# EAGLE design Köpfhörerverstärker PSU Rev 1.1 (EAGLE 6.4)

## Sheet 1 of 2
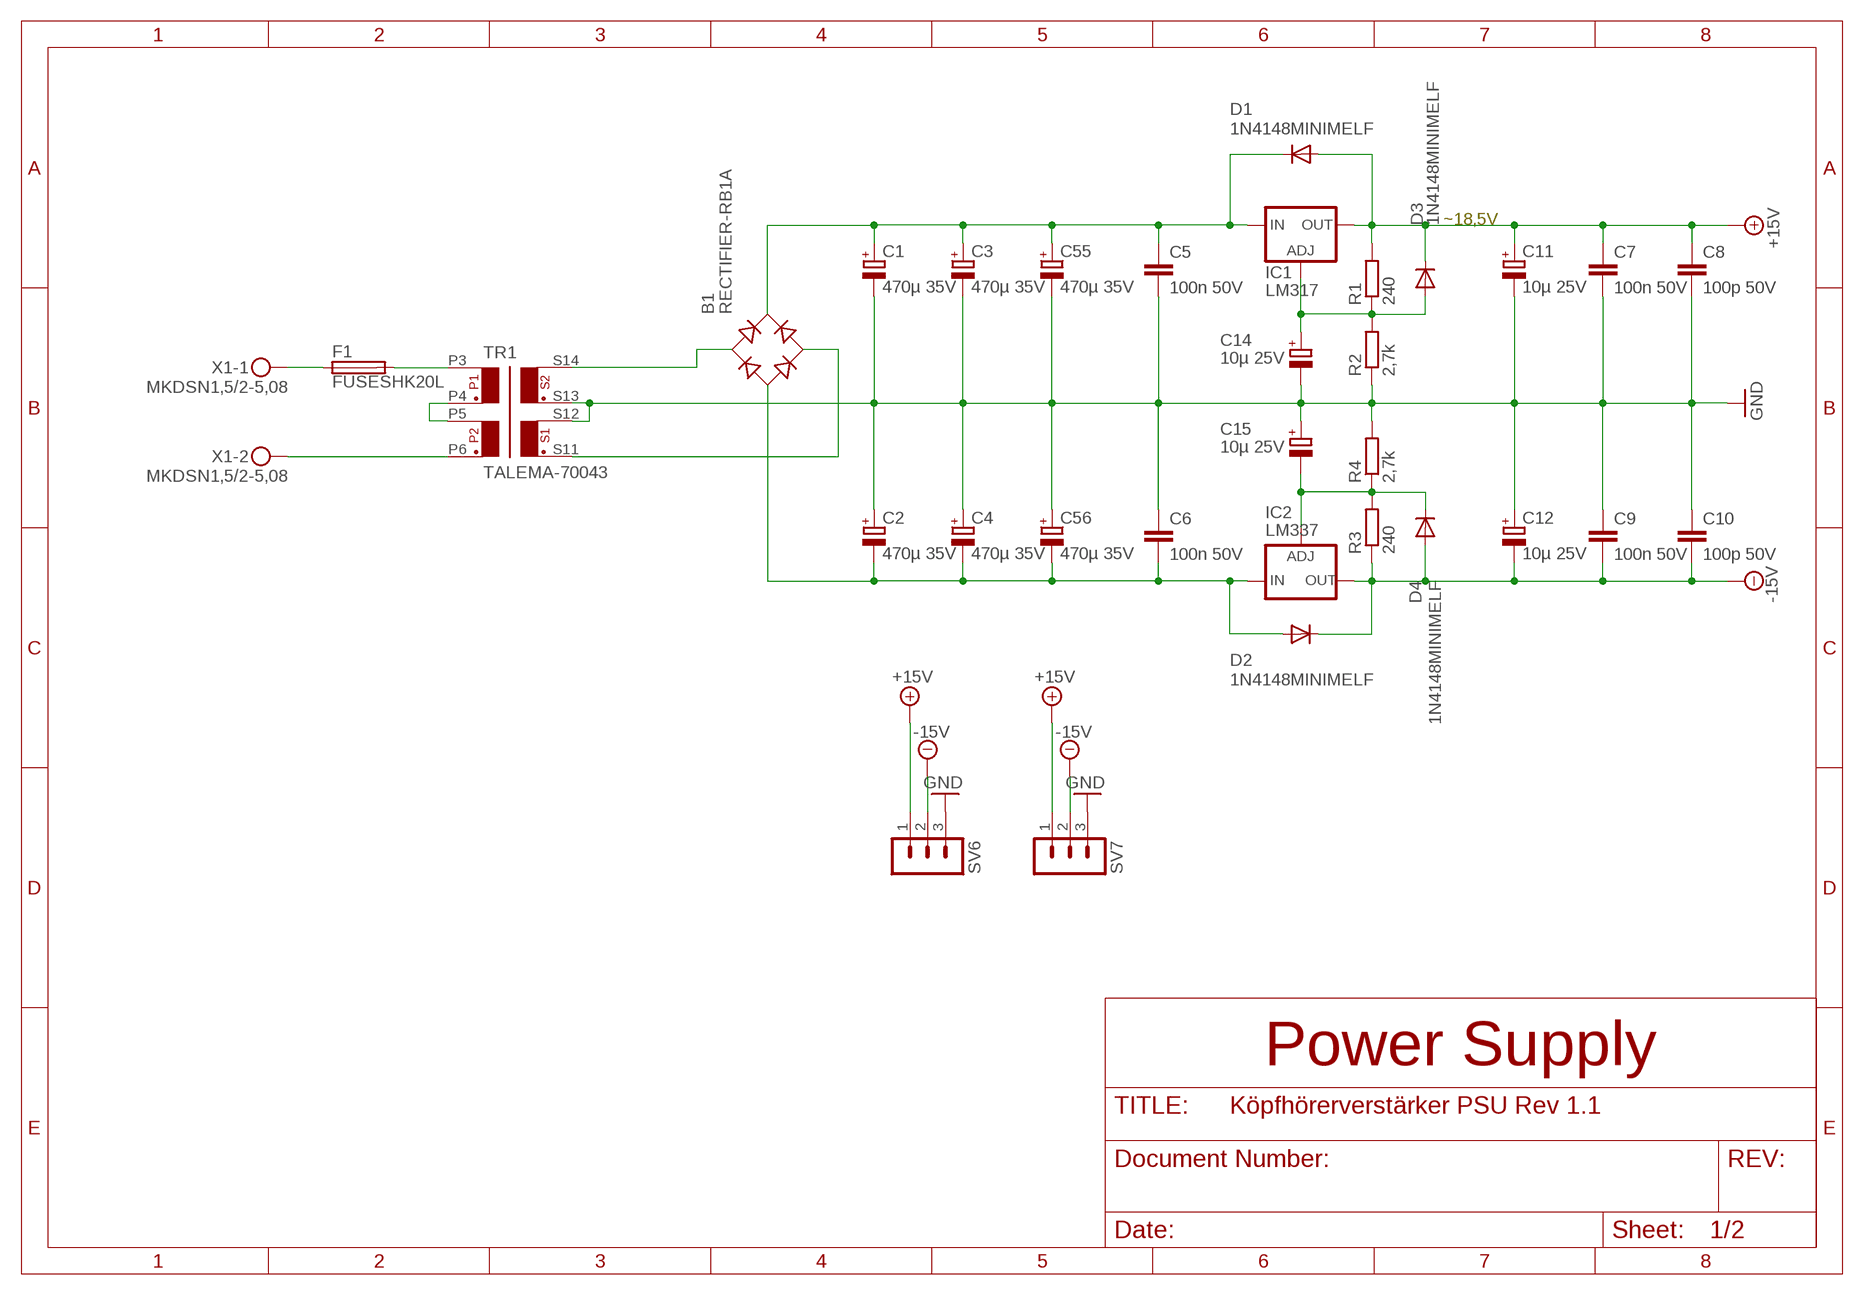
[diagram p0: schematic, sheet 1]

### Parts
B1  RECTIFIER-RB1A  [RB1A]
C1  470µ 35V  CPOL-EUE5-10.5  [E5-10,5]
C2  470µ 35V  CPOL-EUE5-10.5  [E5-10,5]
C3  470µ 35V  CPOL-EUE5-10.5  [E5-10,5]
C4  470µ 35V  CPOL-EUE5-10.5  [E5-10,5]
C5  100n 50V  C-EUC0805  [C0805]
C6  100n 50V  C-EUC0805  [C0805]
C7  100n 50V  C-EUC0805  [C0805]
C8  100p 50V  C-EUC0805  [C0805]
C9  100n 50V  C-EUC0805  [C0805]
C10  100p 50V  C-EUC0805  [C0805]
C11  10µ 25V  CPOL-EUE2.5-5  [E2,5-5]
C12  10µ 25V  CPOL-EUE2.5-5  [E2,5-5]
C14  10µ 25V  CPOL-EUE2.5-5  [E2,5-5]
C15  10µ 25V  CPOL-EUE2.5-5  [E2,5-5]
C55  470µ 35V  CPOL-EUE5-10.5  [E5-10,5]
C56  470µ 35V  CPOL-EUE5-10.5  [E5-10,5]
D1  1N4148MINIMELF  [MINIMELF]
D2  1N4148MINIMELF  [MINIMELF]
D3  1N4148MINIMELF  [MINIMELF]
D4  1N4148MINIMELF  [MINIMELF]
F1  FUSESHK20L  [SHK20L]
IC1  LM317  LM317TL  [317TL]
IC2  LM337  LM337TL  [337TL]
R1  240  R-EU_R0805  [R0805]
R2  2,7k  R-EU_R0805  [R0805]
R3  240  R-EU_R0805  [R0805]
R4  2,7k  R-EU_R0805  [R0805]
SV6  MA03-1  [MA03-1]
SV7  MA03-1  [MA03-1]
TR1  TALEMA-70043  [TALEMA-70043]
X1  MKDSN1,5/2-5,08  [MKDSN1,5/2-5,08]

### Nets
+15V: C7.1 C8.1 C11.+ D1.A D3.C IC1.2(OUT) R1.2 SV6.1 SV7.1 ; also sheet 2
-15V: C9.2 C10.2 C12.- D2.C D4.A IC2.3(OUT) R3.1 SV6.2 SV7.2 ; also sheet 2
GND: C1.- C2.+ C3.- C4.+ C5.2 C6.1 C7.2 C8.2 C9.1 C10.1 C11.- C12.+ C14.- C15.+ C55.- C56.+ R2.1 R4.2 SV6.3 SV7.3 TR1.S12 TR1.S13 ; also sheet 2
N$1: F1.2A TR1.P3
N$2: F1.1A X1.1
N$3: TR1.P6 X1.2
N$4: TR1.P4 TR1.P5
N$5: B1.AC2 TR1.S11
N$6: B1.AC1 TR1.S14
N$8: C14.+ D3.A IC1.1(ADJ) R1.1 R2.2
N$9: C15.- D4.C IC2.1(ADJ) R3.2 R4.1
N$10: B1.- C2.- C4.- C6.2 C56.- D2.A IC2.2(IN)
N$11: B1.+ C1.+ C3.+ C5.1 C55.+ D1.C IC1.3(IN)

### Notes on the sheet
- ~18,5V
- Power Supply

## Sheet 2 of 2
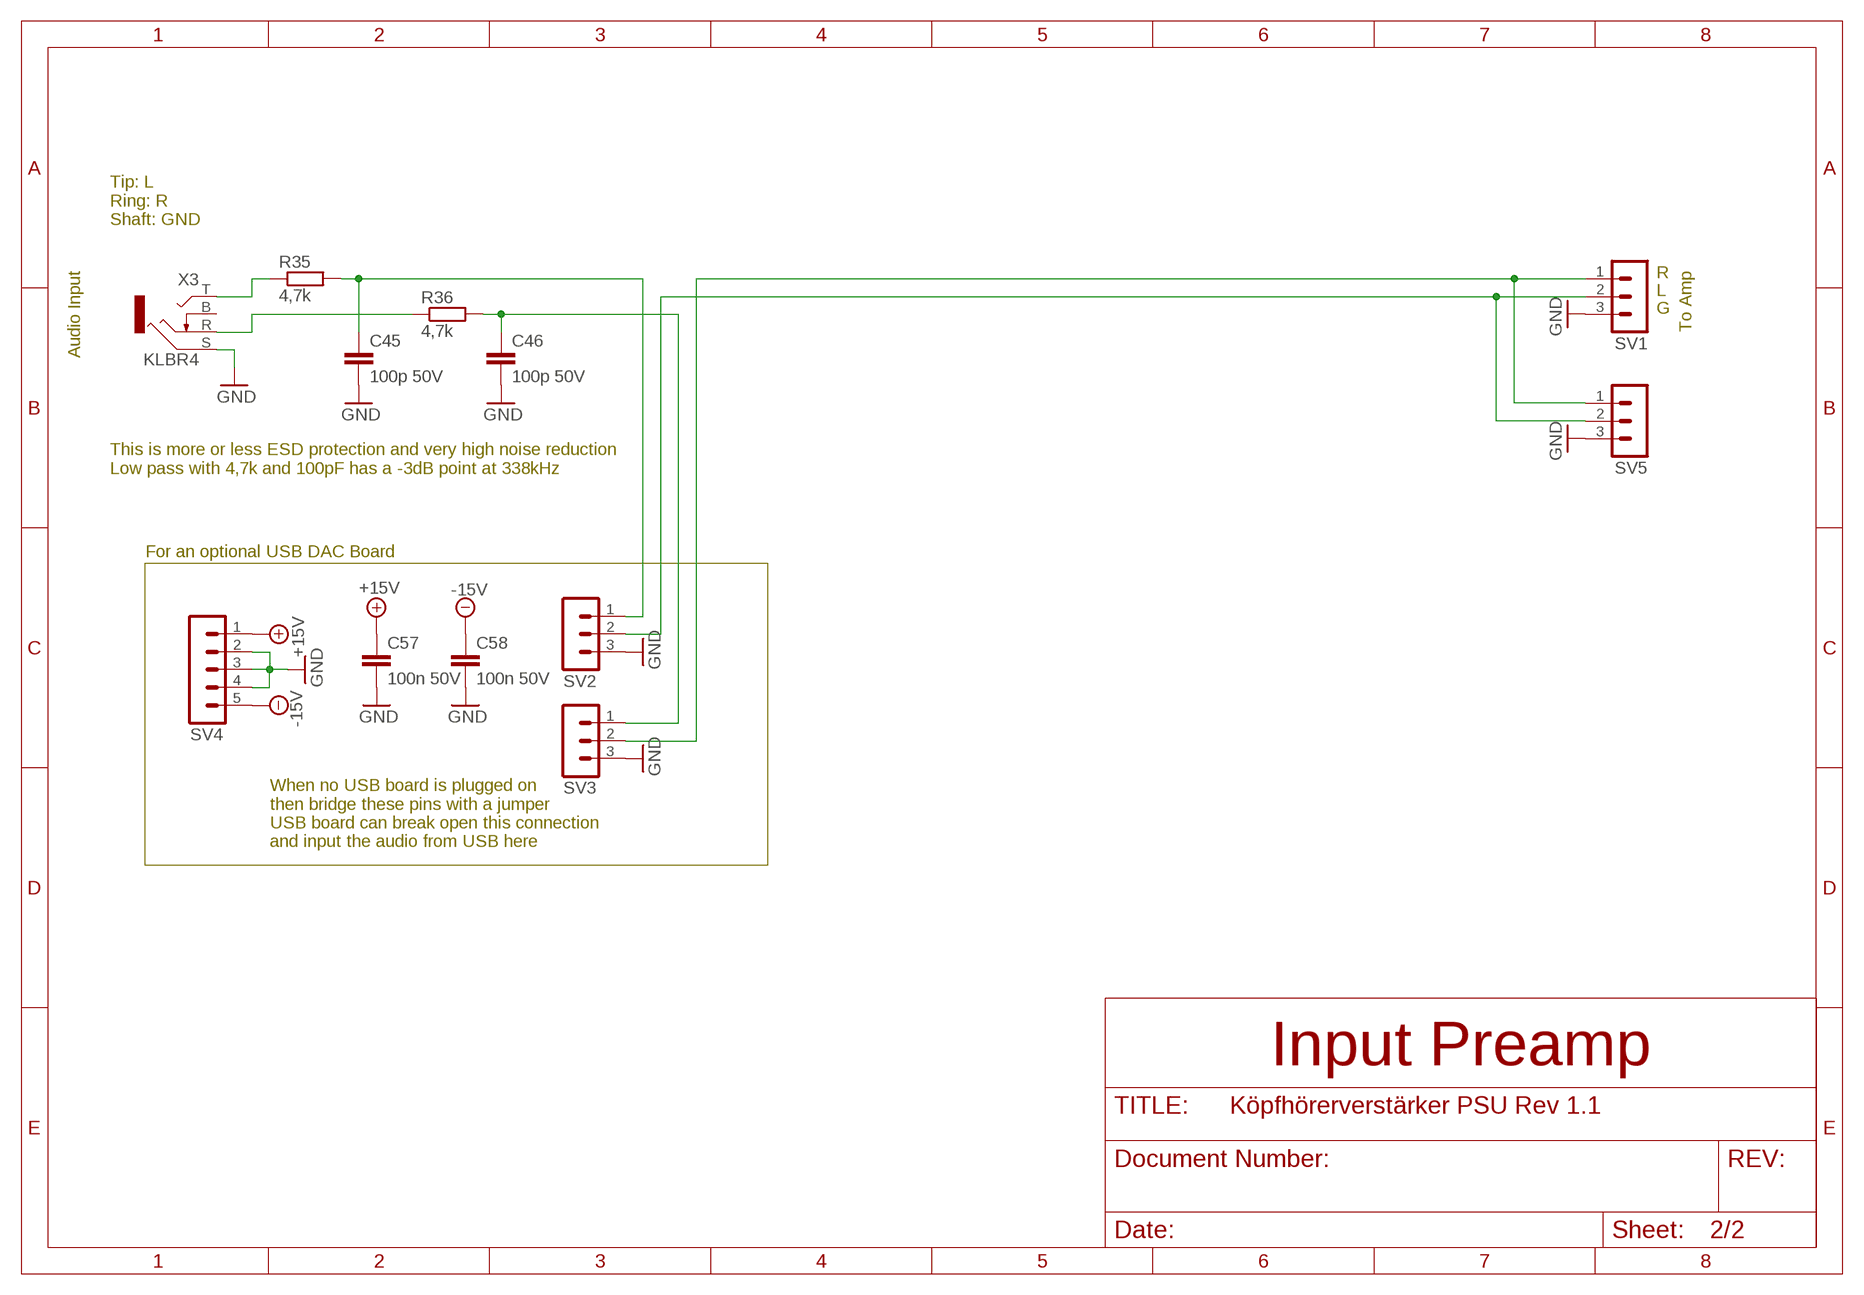
[diagram p1: schematic, sheet 2]

### Parts
C45  100p 50V  C-EU050-025X075  [C050-025X075]
C46  100p 50V  C-EU050-025X075  [C050-025X075]
C57  100n 50V  C-EUC0805  [C0805]
C58  100n 50V  C-EUC0805  [C0805]
R35  4,7k  R-EU_R0805  [R0805]
R36  4,7k  R-EU_R0805  [R0805]
SV1  MA03-1  [MA03-1]
SV2  MA03-1  [MA03-1]
SV3  MA03-1  [MA03-1]
SV4  MA05-1  [MA05-1]
SV5  MA03-1  [MA03-1]
X3  KLBR4  [KLBR4]

### Nets
+15V: C57.1 SV4.1 ; also sheet 1
-15V: C58.1 SV4.5 ; also sheet 1
GND: C45.2 C46.2 C57.2 C58.2 SV1.3 SV2.3 SV3.3 SV4.2 SV4.3 SV4.4 SV5.3 X3.S ; also sheet 1
N$7: SV1.2 SV2.2 SV5.2
N$12: R36.1 X3.R
N$43: R35.1 X3.T
N$45: C45.1 R35.2 SV2.1
N$46: SV1.1 SV3.2 SV5.1
N$54: C46.1 R36.2 SV3.1
Unconnected: X3.B

### Notes on the sheet
- Tip: L
  Ring: R
  Shaft: GND
- R
- L
- Audio Input | G
- To Amp
- This is more or less ESD protection and very high noise reduction
  Low pass with 4,7k and 100pF has a -3dB point at 338kHz
- For an optional USB DAC Board
- When no USB board is plugged on
  then bridge these pins with a jumper
  USB board can break open this connection
  and input the audio from USB here
- Input Preamp

## Library data of the parts
B1 = rectifier:RECTIFIER-: Rectifier
C1-C4 C11 C12 C14 C15 C55 C56 = rcl:CPOL-EU: POLARIZED CAPACITOR, European symbol
C5-C10 C45 C46 C57 C58 = rcl:C-EU: CAPACITOR, European symbol
D1-D4 = diode:1N4148: DIODE high speed (Philips)
F1 = fuse:FUSE: Fuse; OC_FARNELL: unknown; OC_NEWARK: unknown
IC1 = v-reg:LM317TL: VOLTAGE REGULATOR
IC2 = v-reg:LM337TL: VOLTAGE REGULATOR
R1-R4 R35 R36 = rcl:R-EU_: RESISTOR, European symbol
SV1-SV3 SV5-SV7 = con-lstb:MA03-1: PIN HEADER; OC_FARNELL: unknown; OC_NEWARK: unknown
SV4 = con-lstb:MA05-1: PIN HEADER; OC_FARNELL: unknown; OC_NEWARK: unknown
TR1 = trafo:TALEMA-70043: Toroidal transformer 10VA 2x15V 5VA Also known as RKPT10215
X1 = con-phoenix-508:MKDSN1,5/2-5,08: MKDSN 1,5/ 2-5,08 Printklemme Nennstrom: 13,5 A Nennspannung: 250 V Rastermaß: 5,08 mm Polzahl: 2 Anschlussart: Schraubanschluss Montage: Löten Anschlussrichtung Leiter/Platine: 0 ° Artikelnummer: 1729128 Source: http://eshop.phoenixcontact.com .. 1729128.pdf; MPN: MKDSN 1,5/2-5.08; OC_FARNELL: 1792903; OC_NEWARK: 30M2397
X3 = con-lumberg:KLBR4: Jack connectors according to JISC 6560, 3.5 mm Klinkeneinbaukupplung nach JISC 6560, 3,5 mm, 3-polig/ stereo, abgewinkelte Ausführung, mit Öffner, für Leiterplatten Source: Data sheet <http://www.lumberg.com/Produkte/PDFs/KLBR4.pdf>; MPN: KLBR 4; OC_FARNELL: 1217016; OC_NEWARK: 97K2709

## Board
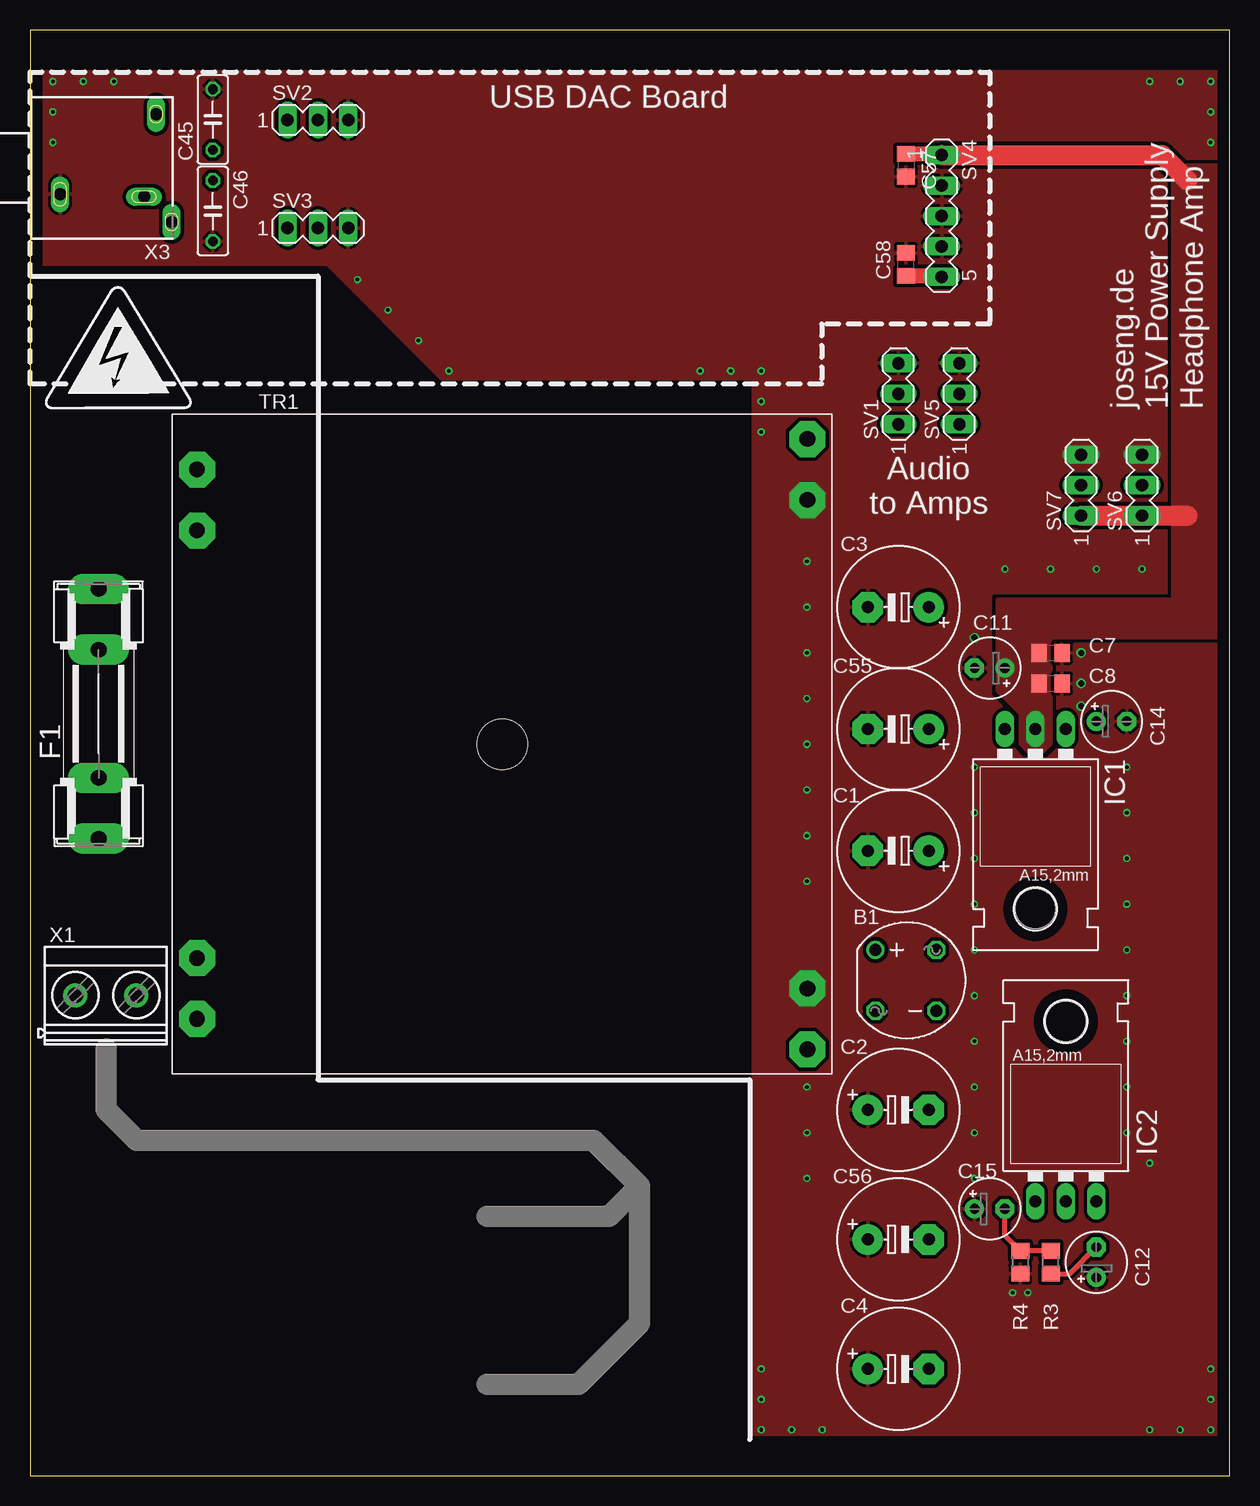
[diagram p2: board, top side]
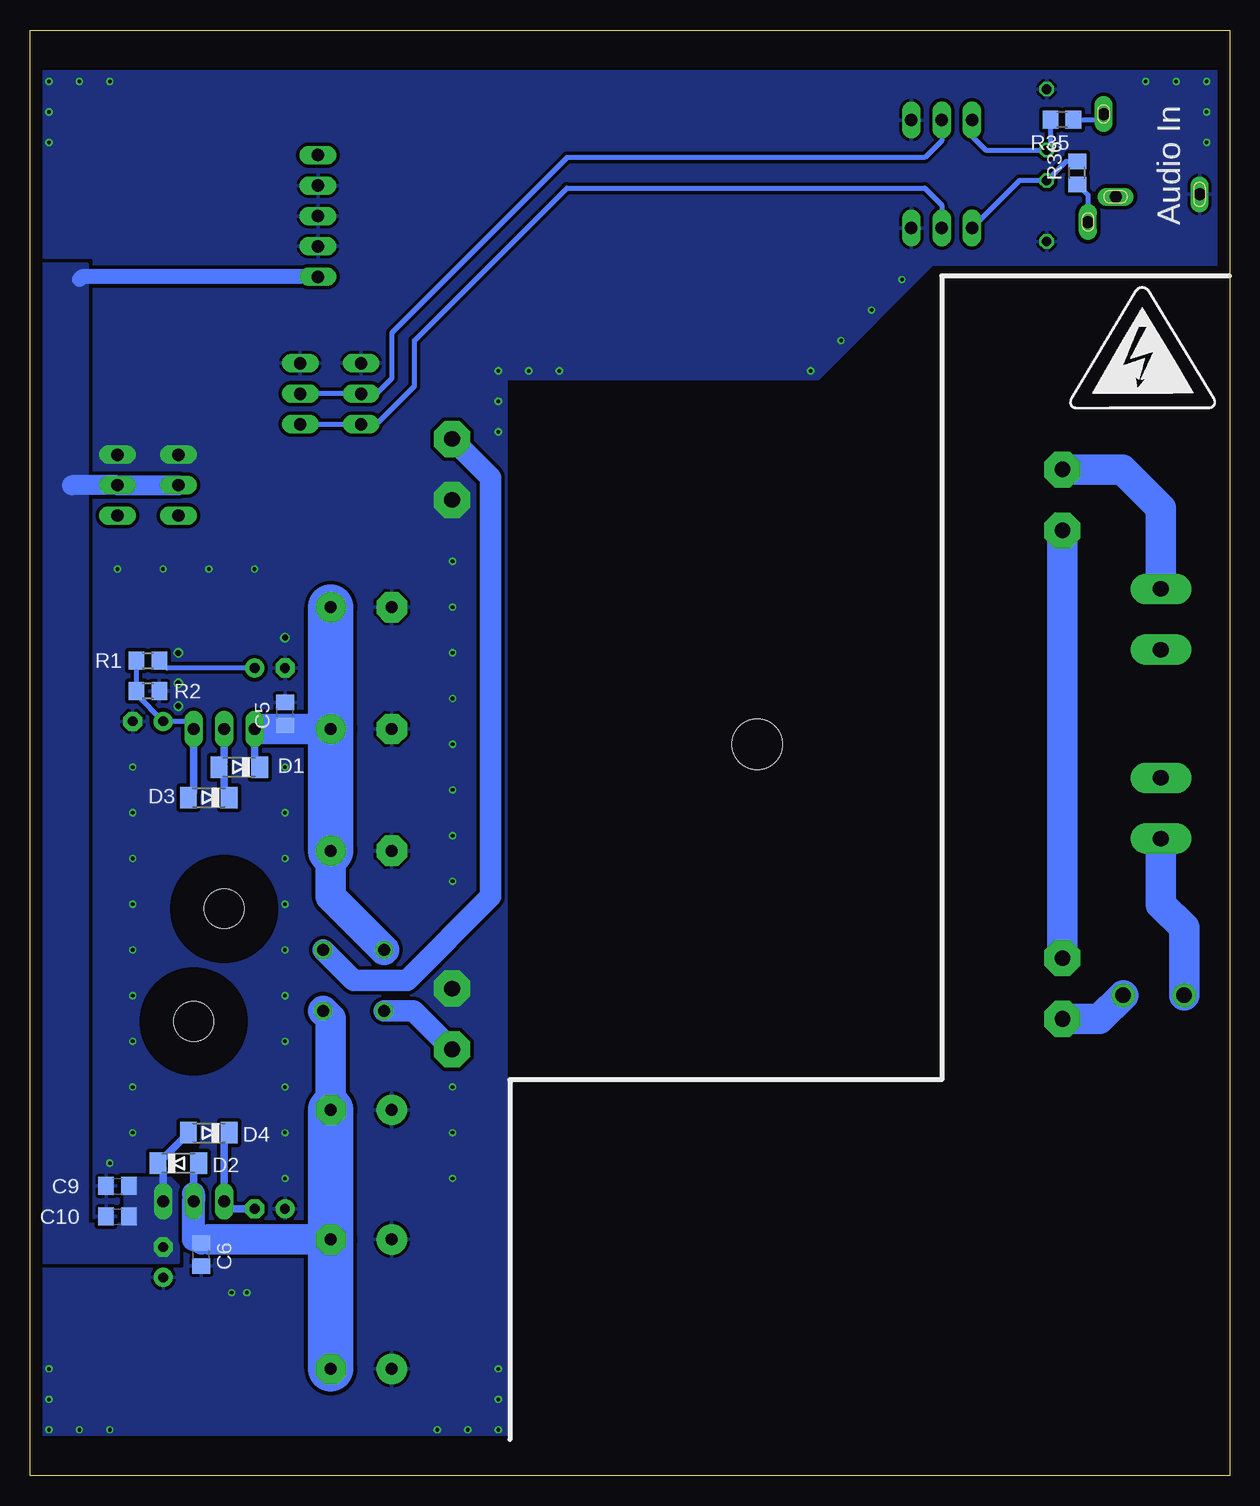
[diagram p3: board, bottom side, seen from below]

Size 100 x 120.5 mm. Coordinates in mm from the lower left corner, seen from the top.
Outline: 0,0 100,0 100,120.5 0,120.5 0,0
Copper layers (1*16): Top 0.035mm / dielectric 1.5mm / Bottom 0.035mm
Design rules "JLCPCB 2Layer 1oz": minimum track width 5mil, minimum drill 0.3mm, track to track 5mil, track to pad 0.2mm, pad to pad 5mil, via to via 0.2mm, smd to smd 5mil, copper to edge 40mil, drill to drill 0.5mm, minimum pad ring 0.15mm, minimum via ring 0.15mm, stop-mask expansion 2mil, vias tented up to drill 0.3mm, thermal gap 10mil
tKeepout: area 0,3 to 30,31
tRestrict: area 0,0 to 100,3; area 0,117.5 to 100,120.5
bRestrict: area 0,0 to 100,3; area 0,117.5 to 100,120.5

### Footprints (pad centres in the part's own frame; a part is rotated, then mirrored left to right if it is on the bottom)
RB1A = drill 1.016: + -2.54,2.54 | drill 1.016 octagon: - 2.54,-2.54; AC1 2.54,2.54; AC2 -2.54,-2.54
E5-10,5 = drill 1.016 pad 2.54: + -2.54,0 | drill 1.016 pad 2.54 octagon: - 2.54,0
C0805 = smd 1.3 x 1.5: 1 -0.95,0; 2 0.95,0
E2,5-5 = drill 0.813 pad 1.6: + -1.27,0 | drill 0.813 pad 1.6 octagon: - 1.27,0
C050-025X075 = drill 0.813 octagon: 1 -2.54,0; 2 2.54,0
MINIMELF = smd 1.4 x 1.8: A 1.7,0; C -1.7,0
SHK20L = drill 1.321 pad 2.54 long: 1A -10.414,0; 1B -5.334,0; 2A 10.414,0; 2B 5.334,0
317TL = drill 1.016 long: 1 -2.54,-3.81; 2 0,-3.81; 3 2.54,-3.81 | hole 3.302: 0,11.176
337TL = drill 1.016 long: 1 -2.54,-3.81; 2 0,-3.81; 3 2.54,-3.81 | hole 3.302: 0,11.176
R0805 = smd 1.3 x 1.5: 1 -0.95,0; 2 0.95,0
MA03-1 = drill 1.016 long: 1 -2.54,0; 2 0,0; 3 2.54,0
MA05-1 = drill 1.016 long: 1 -5.08,0; 2 -2.54,0; 3 0,0; 4 2.54,0; 5 5.08,0
TALEMA-70043 = drill 1.3 pad 3 octagon: P3 -25.44,22.9; P4 -25.44,17.82; P5 -25.44,-17.82; P6 -25.44,-22.9; S11 25.44,-25.44; S12 25.44,-20.36; S13 25.44,20.36; S14 25.44,25.44 | hole 4.2: 0,0
MKDSN1,5/2-5,08 = drill 1.3 pad 2: 1 -2.561,0.025; 2 2.519,0.025
KLBR4 = drill 1 pad 1.3 long: B -2.4,-3.5; S -2.2,3.5 | drill 1 pad 1.2 long: R -4.5,-5.8; T 4.5,-4.5

### Placement (x,y rotation side)
B1  73.03,41.27 0 top
C1  72.39,52.07 180 top
C2  72.39,30.48 0 top
C3  72.39,72.39 180 top
C4  72.39,8.89 0 top
C5  78.74,63.5 90 bottom
C6  85.72,18.41 90 bottom
C7  85.09,68.58 0 top
C8  85.09,66.04 0 top
C9  92.71,24.13 0 bottom
C10  92.71,21.59 0 bottom
C11  80.01,67.31 180 top
C12  88.9,17.78 90 top
C14  90.17,62.87 0 top
C15  80.01,22.23 0 top
C45  15.24,113.03 90 top
C46  15.24,105.41 270 top
C55  72.39,62.23 180 top
C56  72.39,19.68 0 top
C57  73.03,109.22 270 top
C58  73.03,100.97 90 top
D1  82.55,59.05 180 bottom
D2  87.63,26.04 0 bottom
D3  85.09,56.52 180 bottom
D4  85.09,28.57 180 bottom
F1  5.71,63.5 90 top
IC1  83.82,58.42 180 top
IC2  86.36,26.67 0 top
R1  90.17,67.94 0 bottom
R2  90.17,65.41 180 bottom
R3  85.09,17.78 90 top
R4  82.55,17.78 270 top
R35  13.97,113.03 180 bottom
R36  12.7,108.58 90 bottom
SV1  72.39,90.17 90 top
SV2  24,113 0 top
SV3  24,104 0 top
SV4  76,105 270 top
SV5  77.47,90.17 90 top
SV6  92.71,82.55 90 top
SV7  87.63,82.55 90 top
TR1  39.37,60.96 0 top
U$1  [HIGH_VOLTAGE_10MM]  1.27,88.9 0 top
U$2  [HIGH_VOLTAGE_10MM]  13.34,88.9 0 bottom
X1  6.35,40.01 0 top
X3  6,109 90 top

### Tracks (layer width: path | path; a pad name or v marks a point on that pad's centre or on a via)
+15V
  Top 1.27: C57.1 75.91,110.17 SV4.1
  Top 1.676: SV7.1 SV6.1 96.52,80.01 | SV4.1 94.39,110.08 96.52,107.95
  Bottom 0.406: C11.+ 88.58,67.31 R1.2
  Bottom 0.61: IC1.2 83.82,59.48 D1.A 83.82,59.05 83.82,56.95 D3.C
  pour Top (isolate 0.305, no thermals): 99.06,109.22 95.25,109.22 95.25,73.03 80.64,73.03 80.64,69.85 99.06,69.85
  pour Top (isolate 0.305, no thermals): 82.55,60.96 83.19,60.33 84.45,60.33 85.09,60.96 85.09,69.85 80.64,69.85 80.64,65.41 82.55,63.5
-15V
  Top 0.406: R3.1 86.68,16.83 C12.-
  Top 1.27: C58.1 75.91,100.02 SV4.5
  Bottom 0.61: IC2.3 88.9,25.61 D2.C D4.A
  Bottom 1.27: SV4.5 95.66,99.92 95.89,99.69
  Bottom 1.676: 96.52,82.55 SV6.2 SV7.2
  pour Bottom (isolate 0.305, no thermals): 90.17,17.78 99.06,17.78 99.06,100.97 95.25,100.97 95.25,20.95 90.17,20.95
  pour Bottom (isolate 0.305, no thermals): 87.63,24.13 88.27,24.77 91.44,24.77 92.08,24.13 92.08,17.78 87.63,17.78
GND  (via drill 0.3, 0.5)
  other vias: 87.63,68.58 78.74,69.85 87.63,66.04 87.63,64.14 98.42,3.81 98.42,6.35 98.42,8.89 95.89,3.81 93.34,3.81 60.96,3.81 60.96,6.35 60.96,8.89 63.5,3.81 66.04,3.81 98.42,116.2 98.42,113.67 98.42,111.12 95.89,116.2 93.34,116.2 55.88,92.08 58.42,92.08 60.96,92.08 60.96,89.53 60.96,87 93.34,26.04 92.71,75.56 81.92,15.24 78.74,59.05 78.74,55.24 78.74,51.44 78.74,47.62 78.74,43.81 78.74,40.01 78.74,36.2 78.74,32.38 78.74,28.57 78.74,24.77 81.28,75.56 85.09,75.56 88.9,75.56 64.77,68.58 64.77,64.77 64.77,60.96 64.77,57.15 64.77,24.77 64.77,32.38 64.77,28.57 91.44,40.01 91.44,36.2 91.44,32.38 91.44,28.57 91.44,43.81 91.44,47.62 91.44,51.44 91.44,55.24 91.44,59.05 64.77,72.39 64.77,76.2 64.77,53.34 64.77,49.53 1.91,116.2 4.45,116.2 6.99,116.2 1.91,113.67 1.91,111.12 29.84,97.16 27.3,99.69 32.38,94.61 34.92,92.08 83.19,15.24
  pour Bottom (isolate 0.305, rank 6): 60.33,3.17 100.33,3.17 100.33,118.75 0,118.75 0,100.97 24.77,100.97 34.29,91.44 60.33,91.44
  pour Top (isolate 0.305, rank 6): 60.33,3.17 100.33,3.17 100.33,118.75 0,118.75 0,100.97 24.77,100.97 34.29,91.44 60.33,91.44
  pour Top (isolate 0.305, no thermals): 62.23,83.82 67.31,83.82 67.31,78.74 62.23,78.74
  pour Bottom (isolate 0.305, no thermals): 62.23,83.82 67.31,83.82 67.31,78.74 62.23,78.74
  pour Bottom (isolate 0.305, no thermals): 62.23,43.18 67.31,43.18 67.31,38.1 62.23,38.1
  pour Top (isolate 0.305, no thermals): 62.23,43.18 67.31,43.18 67.31,38.1 62.23,38.1
  pour Top (isolate 0.305, no thermals): 85.72,86.36 94.61,86.36 94.61,83.82 85.72,83.82
  pour Bottom (isolate 0.305, no thermals): 85.72,86.36 94.61,86.36 94.61,83.82 85.72,83.82
N$1
  Bottom 2.54: F1.2A 5.71,80.64 8.93,83.86 TR1.P3
N$2
  Bottom 2.54: X1.1 3.79,45.7 5.71,47.62 F1.1A
N$3
  Bottom 2.54: TR1.P6 10.84,38.06 X1.2
N$4
  Bottom 2.54: TR1.P4 TR1.P5
N$5
  Bottom 1.778: B1.AC2 68.03,38.73 TR1.S11
N$6
  Bottom 1.778: TR1.S14 61.59,83.19 61.59,48.26 68.58,41.27 73.03,41.27 B1.AC1
N$7
  Bottom 0.406: SV2.2 24,111.25 25.4,109.86 55.24,109.86 69.85,95.25 69.85,91.44 71.12,90.17 SV1.2 SV5.2
N$8
  Bottom 0.406: IC1.1 87,62.87 C14.+ 91.12,65.08 R2.2 R1.1
  Bottom 0.61: IC1.1 86.36,56.95 D3.A
N$9
  Top 0.406: R3.2 R4.1 81.28,20 C15.-
  Bottom 0.61: D4.C 83.82,28.14 IC2.1 83.19,22.23 C15.-
N$10
  Bottom 0.61: 86.36,23.5 86.36,25.61 D2.A
  Bottom 1.93: 86.36,23.5 IC2.2 86.36,19.68 85.72,19.68 | 85.09,19.68 85.72,19.68 | 85.72,19.68 C6.2
  Bottom 2.54: B1.- 74.93,38.1 C2.- | C56.- 85.09,19.68
  Bottom 3.81: C4.- C56.- C2.-
N$11
  Bottom 0.61: D1.C 81.28,59.48 IC1.3
  Bottom 1.27: 80.64,62.23 IC1.3 | C5.1 79.06,62.23 80.01,62.23
  Bottom 2.54: B1.+ 74.93,48.26 C1.+ | C55.+ 80.01,62.23 80.64,62.23
  Bottom 3.81: C1.+ C55.+ C3.+
N$12
  Bottom 0.406: R36.1 11.8,106.73 X3.R
N$43
  Bottom 0.406: R35.1 10.97,113.03 X3.T
N$45
  Bottom 0.406: R35.2 14.92,110.81 C45.1 20.32,110.49 21.46,111.63 SV2.1
N$46
  Bottom 0.406: SV5.1 SV1.1 71.12,87.63 67.94,90.81 67.94,94.61 55.24,107.31 25.4,107.31 24,105.92 SV3.2
N$54
  Bottom 0.406: SV3.1 17.51,107.95 C46.1 13.65,109.53 R36.2

### Text on the board
tPlace: USB DAC Board | joseng.de / 15V Power Supply / Headphone Amp | Audio / to Amps
bPlace: Audio In
tDocu: Cable / Routing | C14 230V Input / Connector